# Altium schematic sheet InterfacesA_CONNECTORS.SchDoc
size A
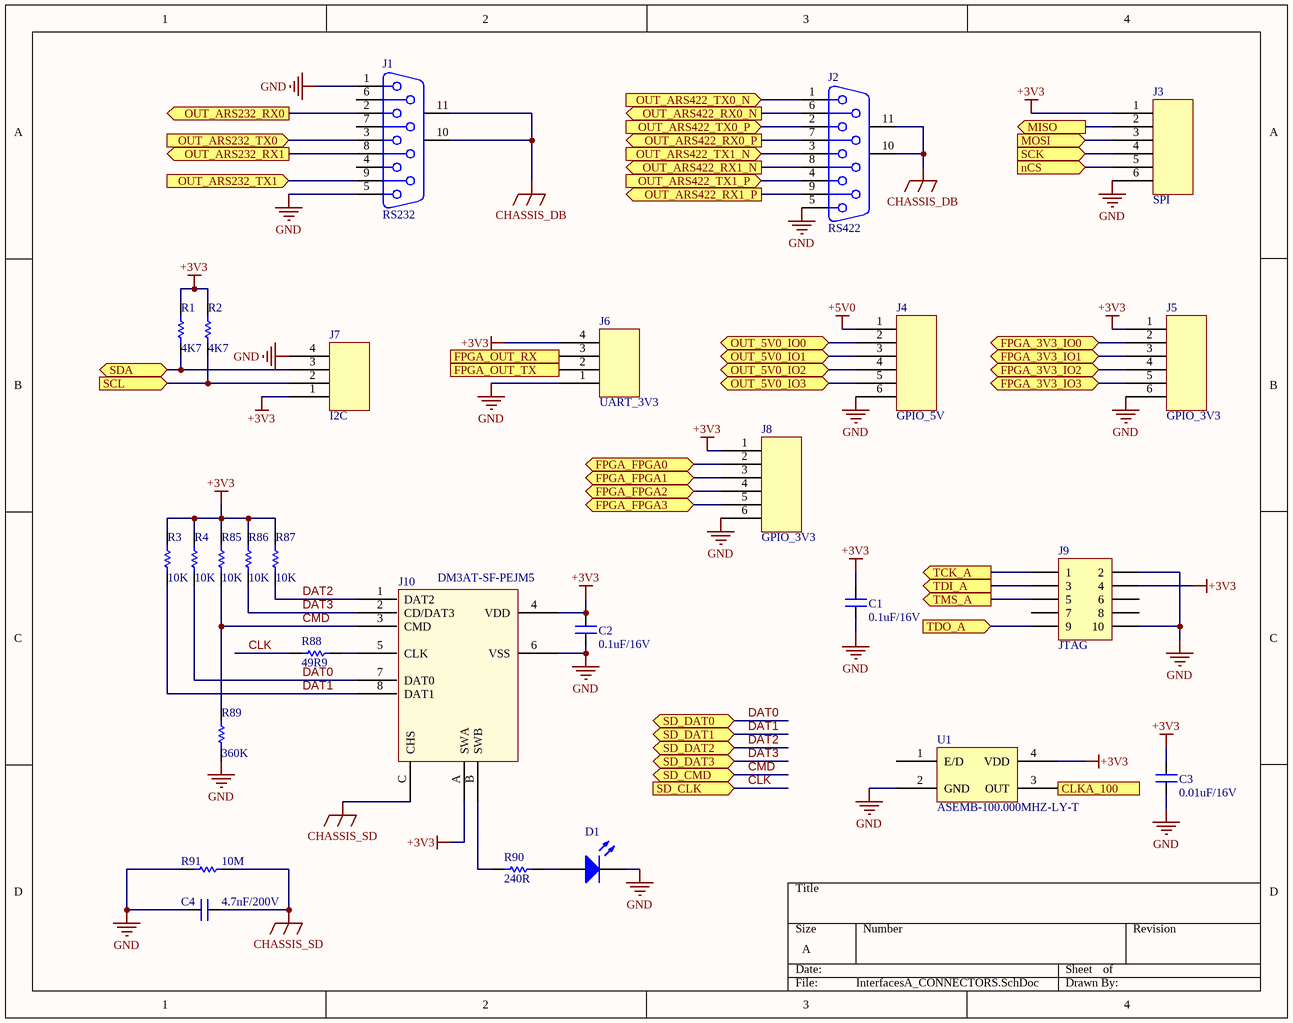
[diagram p0: InterfacesA_CONNECTORS.SchDoc]

## Parts
C1  value 0.1uF/16V  [CAP_0805]  (hidden comment: CAP_0805)
C2  value 0.1uF/16V  [CAP_0805]  (hidden comment: CAP_0805)
C3  value 0.01uF/16V  [CAP_0805]  (hidden comment: CAP_0805)
C4  value 4.7nF/200V  [CAP_0805]  (hidden comment: CAP_0805)
D1  LED_0603  [LED_0603]  (value not drawn)
J1  RS232  [D09S33E4GV00LF]
J2  RS422  [D09S33E4GV00LF]
J3  SPI  [HEADER_6]
J4  GPIO_5V  [HEADER_6]
J5  GPIO_3V3  [HEADER_6]
J6  UART_3V3  [HEADER_4]
J7  I2C  [HEADER_4]
J8  GPIO_3V3  [HEADER_6]
J9  JTAG  [HEADER 5x2]
J10  DM3AT-SF-PEJM5  [DM3AT-SF-PEJM5]
R1  value 4K7  [RES_0805]  (hidden comment: RES_0805)
R2  value 4K7  [RES_0805]  (hidden comment: RES_0805)
R3  value 10K  [RES_0805]  (hidden comment: RES_0805)
R4  value 10K  [RES_0805]  (hidden comment: RES_0805)
R85  value 10K  [RES_0805]  (hidden comment: RES_0805)
R86  value 10K  [RES_0805]  (hidden comment: RES_0805)
R87  value 10K  [RES_0805]  (hidden comment: RES_0805)
R88  value 49R9  [RES_0805]  (hidden comment: RES_0805)
R89  value 360K  [RES_0805]  (hidden comment: RES_0805)
R90  value 240R  [RES_0805]  (hidden comment: RES_0805)
R91  value 10M  [RES_0805]  (hidden comment: RES_0805)
U1  ASEMB-100.000MHZ-LY-T  [ASEMB-100.000MHZ-LY-T]

## Ports
CLKA_100 (out), FPGA_3V3_IO0 (bidir), FPGA_3V3_IO1 (bidir), FPGA_3V3_IO2 (bidir), FPGA_3V3_IO3 (bidir), FPGA_FPGA0 (bidir), FPGA_FPGA1 (bidir), FPGA_FPGA2 (bidir), FPGA_FPGA3 (bidir), FPGA_OUT_RX (out), FPGA_OUT_TX (in), MISO (out), MOSI (in), nCS (in), OUT_5V0_IO0 (bidir), OUT_5V0_IO1 (bidir), OUT_5V0_IO2 (bidir), OUT_5V0_IO3 (bidir), OUT_ARS232_RX0 (out), OUT_ARS232_RX1 (out), OUT_ARS232_TX0 (in), OUT_ARS232_TX1 (in), OUT_ARS422_RX0_N (out), OUT_ARS422_RX0_P (out), OUT_ARS422_RX1_N (out), OUT_ARS422_RX1_P (out), OUT_ARS422_TX0_N (in), OUT_ARS422_TX0_P (in), OUT_ARS422_TX1_N (in), OUT_ARS422_TX1_P (in), SCK (in), SCL (in), SD_CLK (in), SD_CMD (bidir), SD_DAT0 (bidir), SD_DAT1 (bidir), SD_DAT2 (bidir), SD_DAT3 (bidir), SDA (bidir), TCK_A (out), TDI_A (out), TDO_A (in), TMS_A (out)

## Nets
+3V3: C1.2 C2.2 C3.2 J3.1 J5.1 J6.4 J7.1 J8.1 J9.4 J10.4(VDD) J10.A(SWA) R1.2 R2.2 R3.2 R4.2 R85.2 R86.2 R87.2 U1.4(VDD)
+5V0: J4.1
CHASSIS_DB: J1.10(MH1) J1.11(MH2) J2.10(MH1) J2.11(MH2)
CHASSIS_SD: C4.1 J10.C(CHS) R91.1
GND: C1.1 C2.1 C3.1 C4.2 D1.2(K) J1.1 J1.5 J2.5 J3.6 J4.6 J5.6 J6.1 J7.4 J8.6 J9.2 J9.10 J10.6(VSS) R89.1 R91.2 U1.2(GND)
CLK: R88.2 ; port SD_CLK
CLKA_100: U1.3(OUT) ; port CLKA_100
CMD: J10.3(CMD) R85.1 R89.2 ; port SD_CMD
DAT0: J10.7(DAT0) R4.1 ; port SD_DAT0
DAT1: J10.8(DAT1) R3.1 ; port SD_DAT1
DAT2: J10.1(DAT2) R87.1 ; port SD_DAT2
DAT3: J10.2(CD/DAT3) R86.1 ; port SD_DAT3
FPGA_3V3_IO0: J5.2 ; port FPGA_3V3_IO0
FPGA_3V3_IO1: J5.3 ; port FPGA_3V3_IO1
FPGA_3V3_IO2: J5.4 ; port FPGA_3V3_IO2
FPGA_3V3_IO3: J5.5 ; port FPGA_3V3_IO3
FPGA_FPGA0: J8.2 ; port FPGA_FPGA0
FPGA_FPGA1: J8.3 ; port FPGA_FPGA1
FPGA_FPGA2: J8.4 ; port FPGA_FPGA2
FPGA_FPGA3: J8.5 ; port FPGA_FPGA3
FPGA_OUT_RX: J6.3 ; port FPGA_OUT_RX
FPGA_OUT_TX: J6.2 ; port FPGA_OUT_TX
MISO: J3.2 ; port MISO
MOSI: J3.3 ; port MOSI
nCS: J3.5 ; port nCS
OUT_5V0_IO0: J4.2 ; port OUT_5V0_IO0
OUT_5V0_IO1: J4.3 ; port OUT_5V0_IO1
OUT_5V0_IO2: J4.4 ; port OUT_5V0_IO2
OUT_5V0_IO3: J4.5 ; port OUT_5V0_IO3
OUT_ARS232_RX0: J1.2 ; port OUT_ARS232_RX0
OUT_ARS232_RX1: J1.8 ; port OUT_ARS232_RX1
OUT_ARS232_TX0: J1.3 ; port OUT_ARS232_TX0
OUT_ARS232_TX1: J1.9 ; port OUT_ARS232_TX1
OUT_ARS422_RX0_N: J2.6 ; port OUT_ARS422_RX0_N
OUT_ARS422_RX0_P: J2.7 ; port OUT_ARS422_RX0_P
OUT_ARS422_RX1_N: J2.8 ; port OUT_ARS422_RX1_N
OUT_ARS422_RX1_P: J2.9 ; port OUT_ARS422_RX1_P
OUT_ARS422_TX0_N: J2.1 ; port OUT_ARS422_TX0_N
OUT_ARS422_TX0_P: J2.2 ; port OUT_ARS422_TX0_P
OUT_ARS422_TX1_N: J2.3 ; port OUT_ARS422_TX1_N
OUT_ARS422_TX1_P: J2.4 ; port OUT_ARS422_TX1_P
SCK: J3.4 ; port SCK
SCL: J7.2 R2.1 ; port SCL
SDA: J7.3 R1.1 ; port SDA
TCK_A: J9.1 ; port TCK_A
TDI_A: J9.3 ; port TDI_A
TDO_A: J9.9 ; port TDO_A
TMS_A: J9.5 ; port TMS_A
NetD1_1: D1.1(A) R90.1
NetJ10_5: J10.5(CLK) R88.1
NetJ10_B: J10.B(SWB) R90.2

Not connected (* = marked no-connect by the designer): J1 4 6 7; J9 6 7 8; U1 1(E/D)

## Library data of the parts
J1 J2 = D09S33E4GV00LF: Supplier 1: Digi-Key; Supplier Part Number 1: 609-5184-ND
J3-J5 J8 = HEADER_6
J6 J7 = HEADER_4
J9 = Header 5X2: Header, 5-Pin, Dual row; LatestRevisionDate: 17-Jul-2002; LatestRevisionNote: Re-released for DXP Platform.; Publisher: Altium Limited
J10 = DM3AT-SF-PEJM5: CONN SM MicroSD; Supplier 1: Digi-Key; Supplier Part Number 1: HR1964CT-ND
U1 = ASEMB-100.000MHZ-LY-T: Supplier 1: Digi-Key; Supplier Part Number 1: 535-11083-1-ND